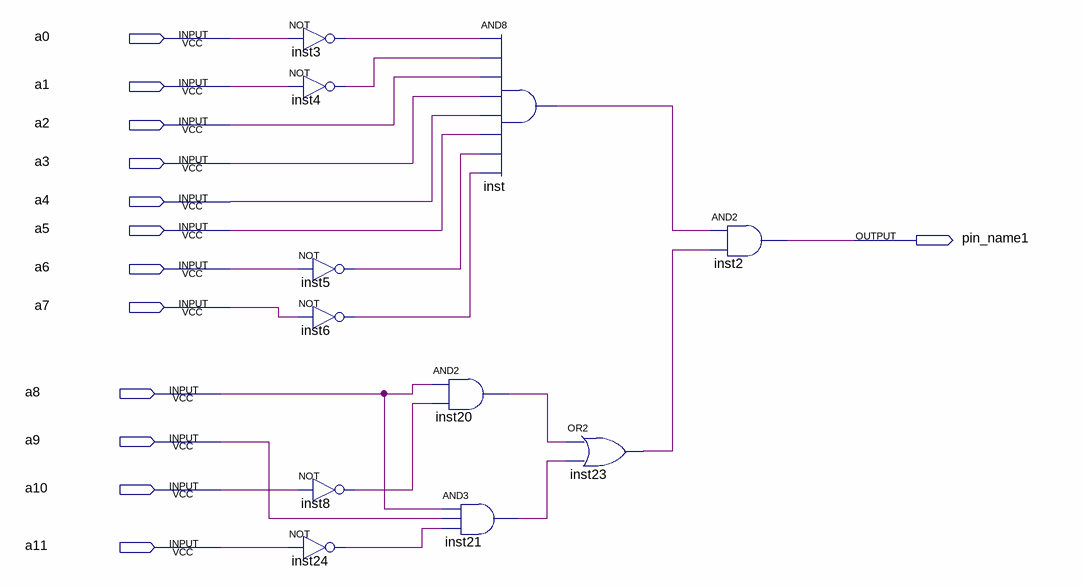
[diagram p0: schematic sheet]
// Quartus schematic lab3.bdf as structural Verilog: 11 symbols, 13 pins
module lab3 (
  input  a0,
  input  a1,
  input  a2,
  input  a3,
  input  a4,
  input  a5,
  input  a6,
  input  a7,
  input  a8,
  input  a9,
  input  a10,
  input  a11,
  output pin_name1
);

  wire inst3_out, inst4_out, inst5_out, inst6_out, inst8_out, inst20_out, inst21_out, inst23_out, inst24_out,
       inst_out;

  not inst3 (inst3_out, a0);
  not inst4 (inst4_out, a1);
  not inst5 (inst5_out, a6);
  not inst6 (inst6_out, a7);
  not inst8 (inst8_out, a10);
  not inst24 (inst24_out, a11);
  and inst20 (inst20_out, a8, inst8_out);
  and inst21 (inst21_out, a8, a9, inst24_out);
  and inst (inst_out, inst3_out, inst4_out, a2, a3, a4, a5, inst5_out, inst6_out);
  or inst23 (inst23_out, inst20_out, inst21_out);
  and inst2 (pin_name1, inst_out, inst23_out);
endmodule
